# EAGLE design fca_giraffe (EAGLE 9.2.2)
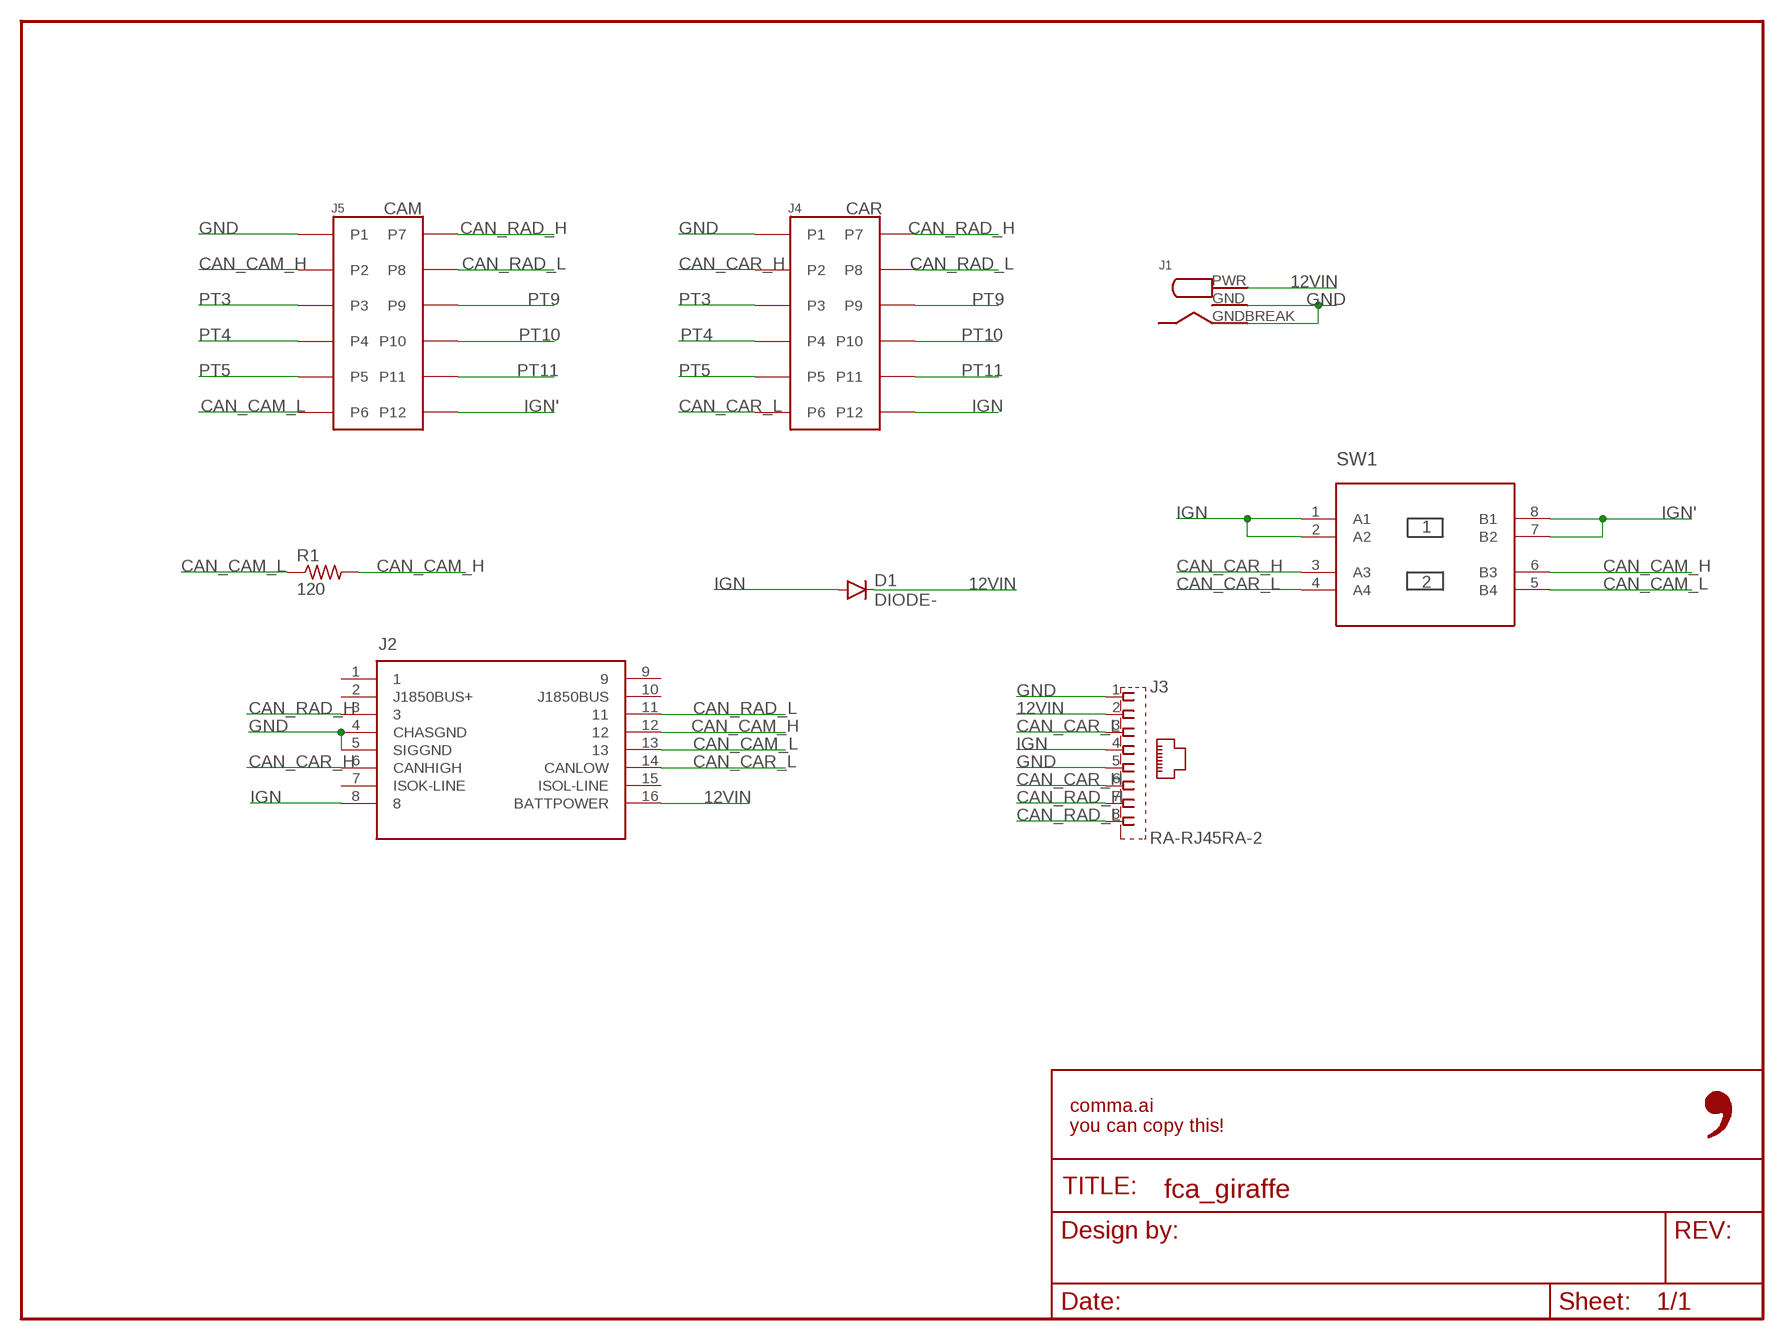
[diagram p0: schematic, sheet 1]

## Parts
D1  DIODE-  [DO-214]
FRAME1  FRAME-LETTER-OPENNO_PACKAGE  [DUMMY]
J1  RASM722PX  [RASM722PX]
J2  OBDII-FEMALE-CUT  [OBDII-FEMALE-MIDCUT]
J3  RA-RJ45RA-2  [RA-RJ45-2]
J4  0348250124  [0348250124]
J5  0348240124  [0348240124]
R1  120  R0603  [0603-R]
SW1  2XDPST-CTS  [2-DPST]

## Nets
12VIN: D1.1(C) J2.16(BATTPOWER) J3.2
CAN_CAM_H: J2.12 J5.P2 R1.2 SW1.6(B3)
CAN_CAM_L: J2.13 J5.P6 R1.1 SW1.5(B4)
CAN_CAR_H: J2.6(CANHIGH) J3.6 J4.P2 SW1.3(A3)
CAN_CAR_L: J2.14(CANLOW) J3.3 J4.P6 SW1.4(A4)
CAN_RAD_H: J2.3 J3.7 J4.P7 J5.P7
CAN_RAD_L: J2.11 J3.8 J4.P8 J5.P8
GND: J1.GNDBREAK J2.4(CHASGND) J2.5(SIGGND) J3.1 J3.5 J4.P1 J5.P1
IGN: D1.2(A) J2.8 J3.4 J4.P12 SW1.1(A1) SW1.2(A2)
IGN': J5.P12 SW1.7(B2) SW1.8(B1)
PT3: J4.P3 J5.P3
PT4: J4.P4 J5.P4
PT5: J4.P5 J5.P5
PT9: J4.P9 J5.P9
PT10: J4.P10 J5.P10
PT11: J4.P11 J5.P11
Unconnected: J2.1 J2.2(J1850BUS+) J2.7(ISOK-LINE) J2.9 J2.10(J1850BUS) J2.15(ISOL-LINE)

## Notes on the sheet
- CAM | CAR

## Power pins joined to a net without a drawn wire
12VIN: J1.PWR(12VIN)
GND: J1.GND

## Library data of the parts
D1 = comma.ai:DIODE
FRAME1 = comma.ai:FRAME-LETTER-OPEN: Schematic Frame - Letter Standard 8.5x11 US Letter frame; DESIGNER: Nobody; VERSION: v01
J1 = RASM722PX:RASM722PX
J2 = comma.ai:OBDII-FEMALE
J3 = comma.ai:RA-RJ45
J4 = 0348240124:0348250124
J5 = 0348240124:0348240124
R1 = comma.ai:R
SW1 = comma.ai:2XDPST

## Board
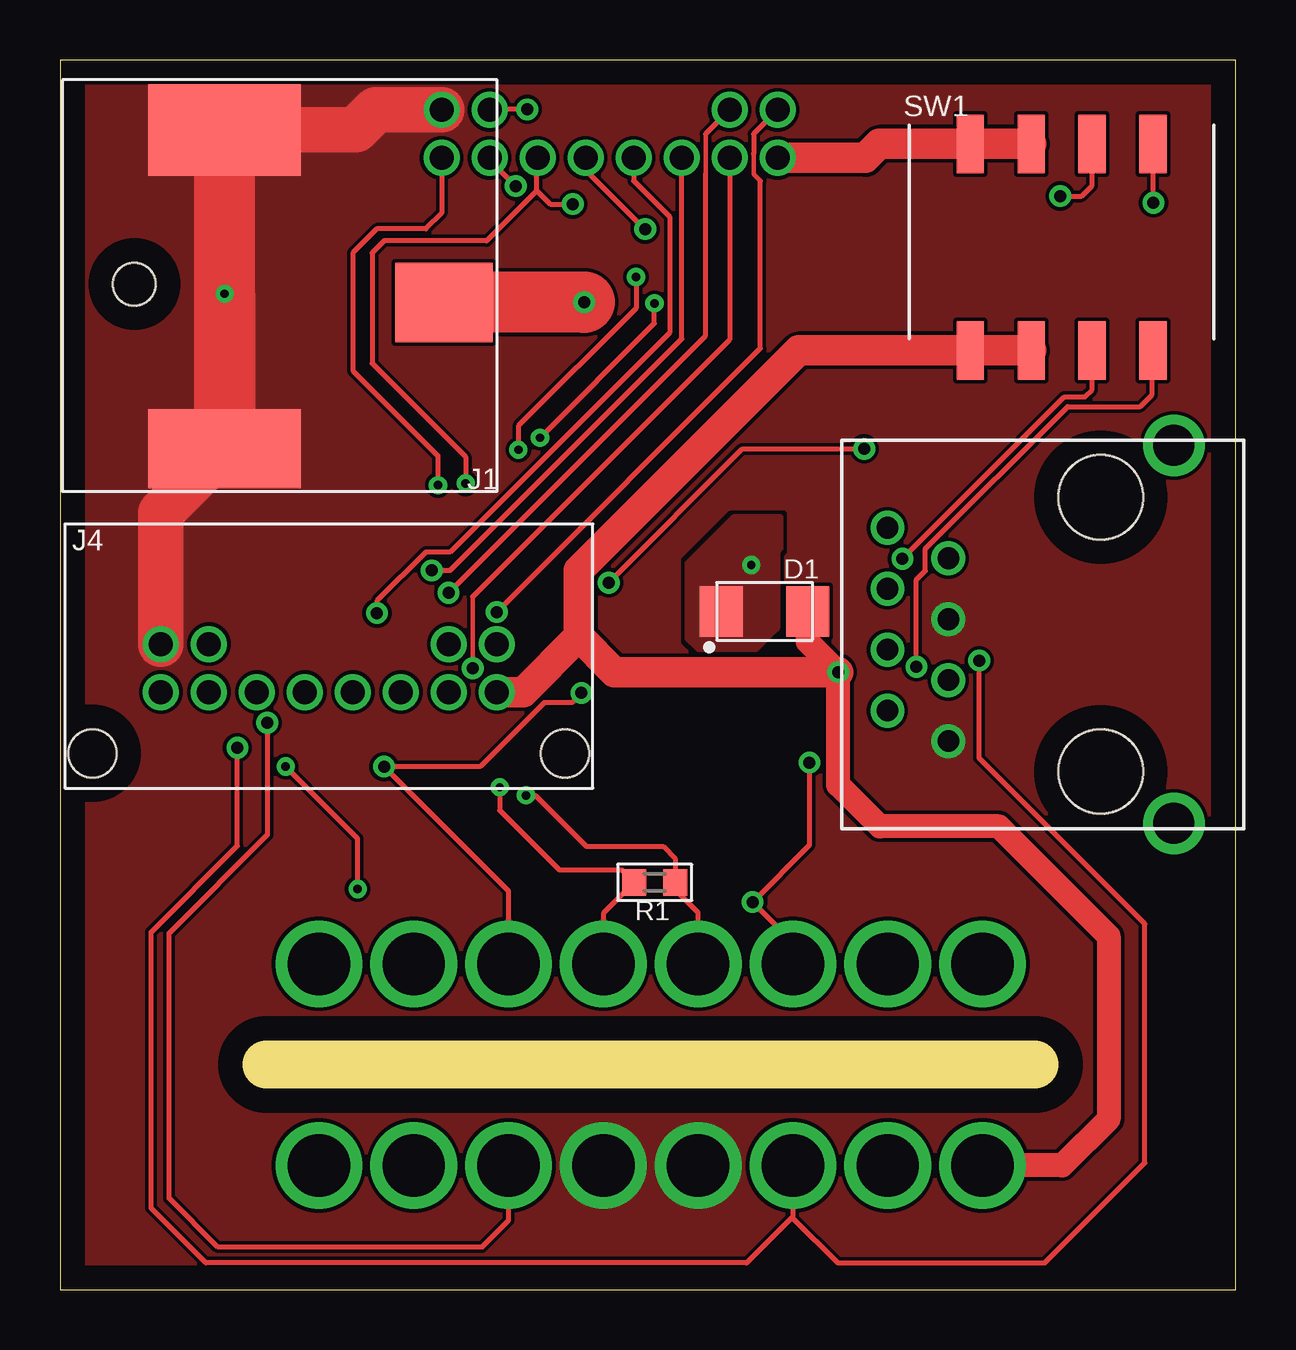
[diagram p1: board, top side]
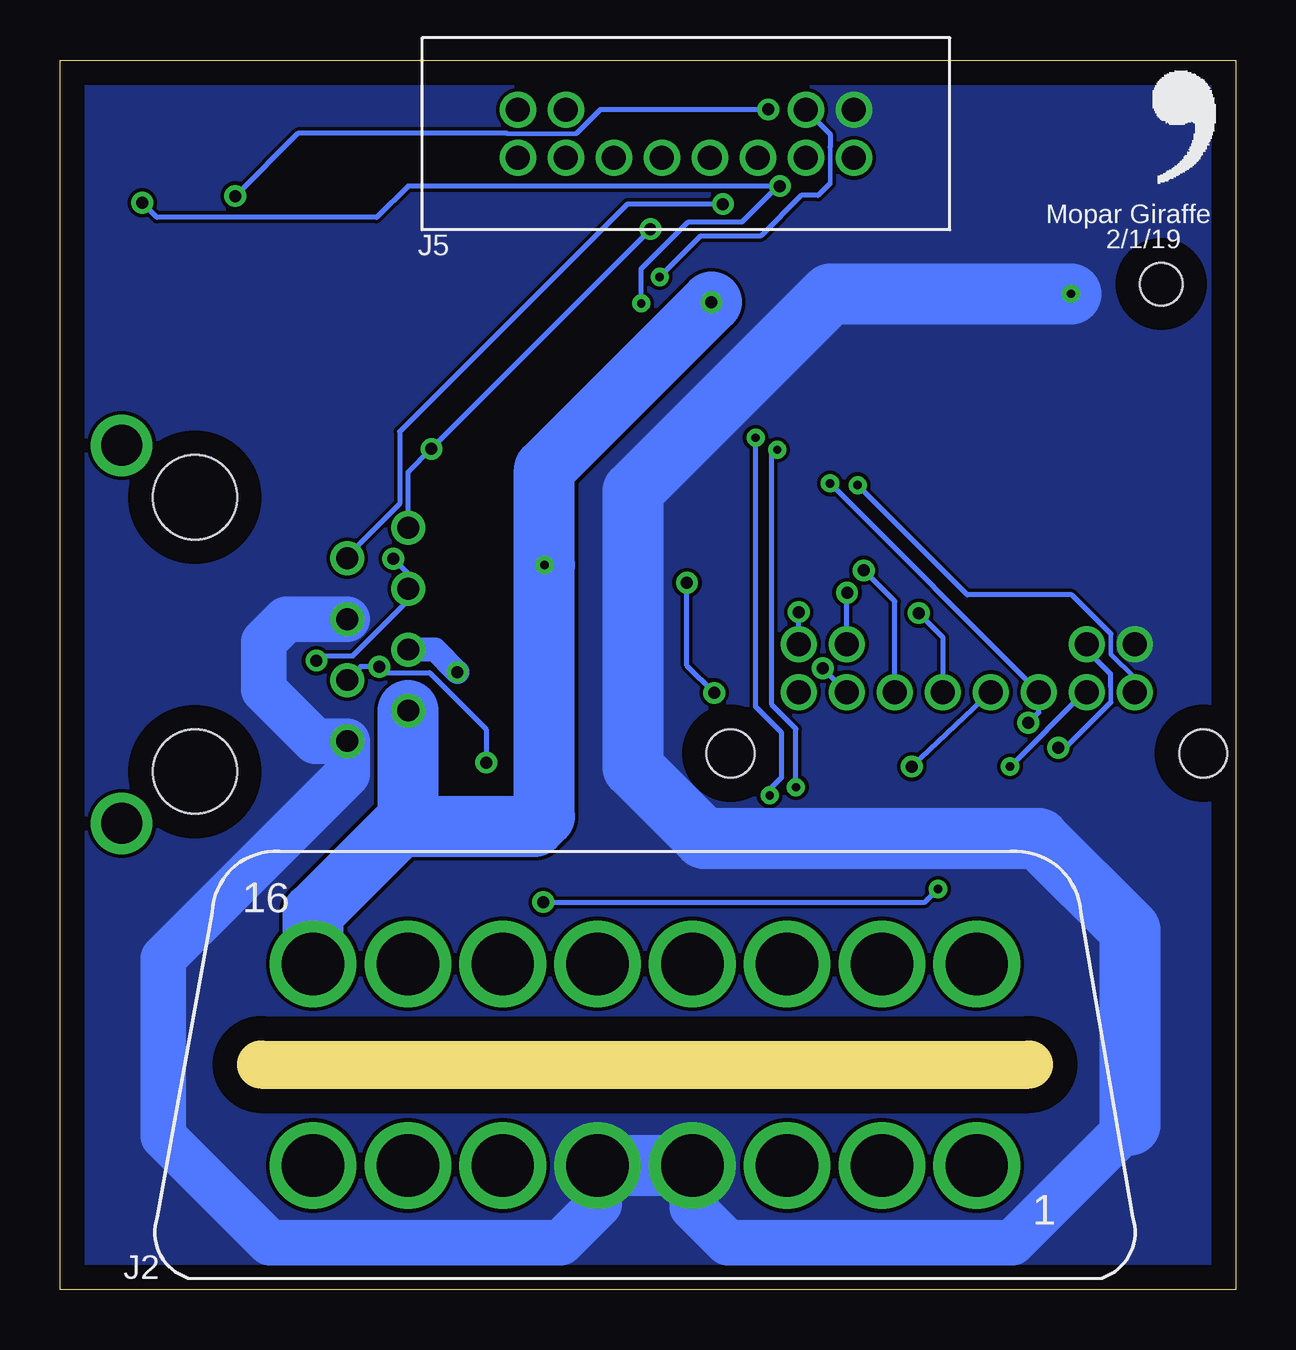
[diagram p2: board, bottom side, seen from below]

Size 48.98 x 51.24 mm. Coordinates in mm from the lower left corner, seen from the top.
Outline: 0,0 48.98,0 48.98,51.24 0,51.24 0,0
Copper layers (1*16): Top 0.035mm / dielectric 1.5mm / Bottom 0.035mm
Design rules "default *": minimum track width 6mil, minimum drill 0.35mm, track to track 6mil, track to pad 6mil, pad to pad 6mil, via to via 6mil, smd to smd 6mil, copper to edge 40mil, drill to drill 6mil, minimum pad ring 10mil, minimum via ring 8mil, stop-mask expansion 4mil, vias tented up to drill 20mil, thermal gap 10mil

### Footprints (pad centres in the part's own frame; a part is rotated, then mirrored left to right if it is on the bottom)
DO-214 = smd 1.8 x 2.1: 1 -1.8,0; 2 1.8,0
RASM722PX = smd 3.302 x 6.35: GND 6.858,3.759 | smd 3.81 x 6.35: GNDBREAK -6.426,3.759 | smd 3.302 x 4.064: PWR 0.762,12.903 | hole 1.778: 0,0
OBDII-FEMALE-MIDCUT = drill 2.6 pad 3.4: 1 13.825,-4.2; 2 9.875,-4.2; 3 5.925,-4.2; 4 1.975,-4.2; 5 -1.975,-4.2; 6 -5.925,-4.2; 7 -9.875,-4.2; 8 -13.825,-4.2; 9 13.825,4.2; 10 9.875,4.2; 11 5.925,4.2; 12 1.975,4.2; 13 -1.975,4.2; 14 -5.925,4.2; 15 -9.875,4.2; 16 -13.825,4.2
RA-RJ45-2 = drill 0.9: 1 4.445,-1.905; 2 3.175,-4.445; 3 1.905,-1.905; 4 0.635,-4.445; 5 -0.635,-1.905; 6 -1.905,-4.445; 7 -3.175,-1.905; 8 -4.445,-4.445 | drill 1.71: P$1 -7.875,7.495; P$2 7.875,7.495 | hole 3.51: -5.715,4.445; 5.715,4.445
0348250124 = drill 1: P1 -7,2; P2 -5,2; P3 5,2; P4 7,2; P5 -7,0; P6 -5,0; P7 -3,0; P8 -1,0; P9 1,0; P10 3,0; P11 5,0; P12 7,0 | hole 2: -9.85,-2.55; 9.85,-2.55
0348240124 = drill 1: P1 7,2; P2 5,2; P3 -5,2; P4 -7,2; P5 7,0; P6 5,0; P7 3,0; P8 1,0; P9 -1,0; P10 -3,0; P11 -5,0; P12 -7,0
0603-R = smd 1 x 1.1: 1 -0.85,0; 2 0.85,0
2-DPST = smd 1.13 x 2.44: 1 -3.81,-4.3; 2 -1.27,-4.3; 3 1.27,-4.3; 4 3.81,-4.3; 5 3.81,4.3; 6 1.27,4.3; 7 -1.27,4.3; 8 -3.81,4.3

### Placement (x,y rotation side)
D1  29.36,28.27 0 top
FRAME1  -13.48,37.45 0 top  (outside the outline)
J1  3.1,41.9 270 top
J2  24.61,9.38 0 bottom
J3  38.92,27.3 270 top
J4  11.2,24.9 0 top
J5  22.9,47.16 0 bottom
R1  24.78,16.98 180 top
SW1  41.73,43.44 0 top
U$1  [LOGO]  4.12,45.79 0 bottom

### Tracks (layer width: path | path; a pad name or v marks a point on that pad's centre or on a via)
12VIN  (via drill 0.35, 0.5)
  Top 2.54: v21.84,41.15 21.83,41.14 J1.PWR
  Bottom 2.54: J2.16 38.44,15.69 34.48,19.65 | 34.48,19.65 J3.2 | 34.48,19.65 34.13,19.3 29.21,19.3 28.8,19.71 v28.8,30.2 28.8,34.19 v21.84,41.15
  pour Top (no thermals): 30.05,32.21 28.07,32.21 26.11,30.25 26.11,28.22 26.11,27.15 26.54,26.72 26.57,26.7 28.24,26.7 29.03,26.7 29.77,27.43 29.92,27.58 29.92,30.76 30.05,30.89 30.05,32.18
CAN_CAM_H  (via drill 0.35, 0.5)
  Top 0.203: v19.47,49.18 17.92,49.18 J5.P2 | v41.68,45.57 42.57,45.57 43,46 SW1.6 | v24,42.2 24,40.9 19.1,36 v19.1,35 | v18.32,20.94 18.32,19.98 20.8,17.5 23.41,17.5 R1.2 22.64,15.68 J2.12
  Bottom 0.178: 16.9,46.1 16.9,47.61 | 27.46,48.18 27.48,48.18 27.49,48.17 30.34,48.17 30.35,48.18
  Bottom 0.203: v18.32,20.94 18.32,23.37 19.35,24.4 19.35,34.75 v19.1,35 | 16.9,46.1 17.4,45.6 18.09,45.6 19.79,43.9 22.3,43.9 v24,42.2 | 27.46,48.18 26.46,49.18 v19.47,49.18 | 30.35,48.18 39.07,48.18 v41.68,45.57 | J5.P2 16.9,48.16 16.9,47.61
CAN_CAM_L  (via drill 0.35, 0.5)
  Top 0.203: v18.99,45.99 17.9,47.07 J5.P6 | v45.56,45.3 45.56,47.72 SW1.5 | J2.13 26.59,15.71 25.63,16.67 R1.1 25.63,17.97 25.13,18.47 21.93,18.47 19.8,20.6 v19.41,20.6 | v20,35.5 24.77,40.27 v24.77,41.1
  Bottom 0.203: v45.56,45.3 44.95,44.68 35.79,44.68 34.48,45.99 v18.99,45.99 19.08,45.99 20.56,44.5 22.8,44.5 24.77,42.53 v24.77,41.1 | v20,35.5 20,24.3 18.93,23.23 18.93,21.34 19.41,20.86 v19.41,20.6
CAN_CAR_H  (via drill 0.5)
  Top 0.203: J2.6 30.54,3.05 | 30.54,3.05 30.54,2.99 32.41,1.12 41.04,1.12 45.21,5.29 45.21,15.24 38.3,22.15 v38.3,26.22 | 30.54,3.05 28.61,1.12 6.08,1.12 3.8,3.4 3.8,14.9 7.39,18.49 v7.39,22.58 | v35.1,30.45 41.85,37.2 42.7,37.2 43,37.5 SW1.3
  Bottom 0.178: 5.2,24.47 5.2,25.01 5.21,25.02 5.21,25.15
  Bottom 0.203: v35.1,30.45 34.48,29.83 J3.6 34.48,28.73 36.78,26.42 38.1,26.42 v38.3,26.22 | v7.39,22.58 7.09,22.58 5.2,24.47 | 5.21,25.15 5.21,25.65 6.2,26.65 J4.P2
CAN_CAR_L  (via drill 0.35, 0.5)
  Top 0.203: J2.14 30.54,14.47 v28.85,16.15 31.23,18.53 v31.23,21.97 | v35.69,25.96 35.69,29.59 36.06,29.96 36.06,30.88 41.98,36.8 45,36.8 45.5,37.3 45.5,39.1 SW1.4 | v12.4,16.7 12.4,18.8 v9.4,21.8
  Bottom 0.203: v31.23,21.97 31.23,23.35 33.59,25.71 35.38,25.71 35.63,25.96 v35.69,25.96 36.46,25.96 J3.3 | v12.4,16.7 12.95,16.15 v28.85,16.15 | v9.4,21.8 6.3,24.9 J4.P6
CAN_RAD_H  (via drill 0.35, 0.5)
  Top 0.203: J2.3 18.69,2.89 17.58,1.78 6.58,1.78 4.55,3.81 4.55,14.86 8.64,18.95 v8.64,23.62 | J5.P7 19.9,46.7 19.87,46.67 19.87,45.8 | 19.87,45.8 17.78,43.7 13.5,43.7 13,43.2 13,38.6 16.9,34.7 v16.9,33.6 | 19.87,45.8 20.43,45.24 v21.36,45.24
  Bottom 0.203: J3.7 37.02,30.56 34.83,32.75 34.83,35.76 25.35,45.24 v21.36,45.24 | v8.64,23.62 8.2,24.06 J4.P7 v16.9,33.6
CAN_RAD_L  (via drill 0.5)
  Top 0.203: J5.P8 21.9,46.65 24.36,44.2 v24.38,44.2 | v22.86,29.46 28.43,35.03 v33.51,35.03 | v21.72,24.87 21.32,24.47 20.17,24.47 17.5,21.8 v13.5,21.8 18.69,16.61 J2.11
  Bottom 0.203: J4.P8 v13.5,21.8 | v21.72,24.87 22.86,26 v22.86,29.46 | J3.8 34.48,34.07 v33.51,35.03 24.38,44.16 v24.38,44.2
GND  (via drill 0.35)
  Top 1.905: J5.P1 13.16,49.16 12.33,48.33 J1.GNDBREAK | J1.GND 4.2,32.38 J4.P1
  Top 2.54: J1.GNDBREAK J1.GND v6.86,41.5
  Bottom 1.905: J2.5 26.53,5.12 26.53,3.57 28.13,1.97 40.25,1.97 44.68,6.4 44.68,13.82 37.02,21.48 J3.1 38.36,22.86 40.5,25 40.5,27 39.56,27.94 J3.5 | J2.4 22.64,3.44 21.17,1.97 9.3,1.97 4.4,6.87
  Bottom 2.54: J2.5 J2.4 | 4.4,6.87 4.4,15 8.2,18.8 22.15,18.8 25.1,21.75 25.1,33.28 16.88,41.5 v6.86,41.5
  pour Top (rank 2, no thermals): -0.43,52.52 -0.43,-0.51 -0.33,-0.61 49.63,-0.61 49.71,-0.69 49.71,52.52
  pour Bottom (rank 2, no thermals): -0.48,52.58 -0.48,-0.48 49.63,-0.48 49.68,-0.43 49.68,52.48 49.66,52.5 -0.41,52.5 -0.43,52.53
IGN  (via drill 0.5)
  Top 1: J2.8 41.75,5.18 43.69,7.11 43.69,14.73 39.12,19.3 34.16,19.3 32.43,21.04 v32.43,25.74 31.16,27.01 D1.2
  Top 1.27: SW1.2 SW1.1 30.78,39.14 21.62,29.98 21.62,27.22 | J4.P12 19.3,24.9 21.62,27.22 | 21.62,27.22 23.1,25.74 v32.43,25.74
  Bottom 1: v32.43,25.74 33.36,26.67 J3.4
IGN'
  Top 1.27: SW1.7 SW1.8 34.14,47.74 33.56,47.16 J5.P12
PT3  (via drill 0.5)
  Top 0.178: 26.9,46.48 26.9,48.16
  Top 0.203: J5.P3 26.9,48.16 | 26.9,46.48 26.9,39.75 v16.19,29.05
  Bottom 0.203: J4.P3 16.2,29.04 v16.19,29.05
PT4  (via drill 0.5)
  Top 0.178: 28.9,47.33 28.9,46.48 29.18,46.2
  Top 0.198: v18.2,28.24 29.18,39.22
  Top 0.203: J5.P4 28.91,48.16 28.91,47.34 28.9,47.33 | 29.18,39.22 29.18,46.2
  Bottom 0.203: J4.P4 v18.2,28.24
PT5  (via drill 0.35)
  Top 0.203: J5.P5 15.9,44.86 15.24,44.2 13.2,44.2 12.2,43.2 12.2,38.3 15.75,34.75 v15.75,33.53
  Bottom 0.178: 5.2,27.33 5.2,26.49 4.2,25.49 J4.P5
  Bottom 0.203: 5.2,27.33 6.82,28.96 11.18,28.96 v15.75,33.53
PT9  (via drill 0.5)
  Top 0.203: J5.P9 23.9,46.2 25.4,44.7 25.4,39.88 16.26,30.73 15.24,30.73 13.21,28.7 v13.21,28.19
  Bottom 0.203: v13.21,28.19 12.2,27.19 J4.P9
PT10  (via drill 0.5)
  Top 0.203: v15.49,29.97 16.26,29.97 25.91,39.62 J5.P10
  Bottom 0.203: J4.P10 14.2,28.68 v15.49,29.97
PT11  (via drill 0.5)
  Top 0.178: v17.2,25.9 17.2,28.88
  Top 0.198: J5.P11 27.9,39.59 17.2,28.88
  Bottom 0.203: J4.P11 v17.2,25.9

### Text on the board
bPlace: Mopar Giraffe | 2/1/19